# EAGLE schematic 05A-010 (EAGLE 9.6.2)
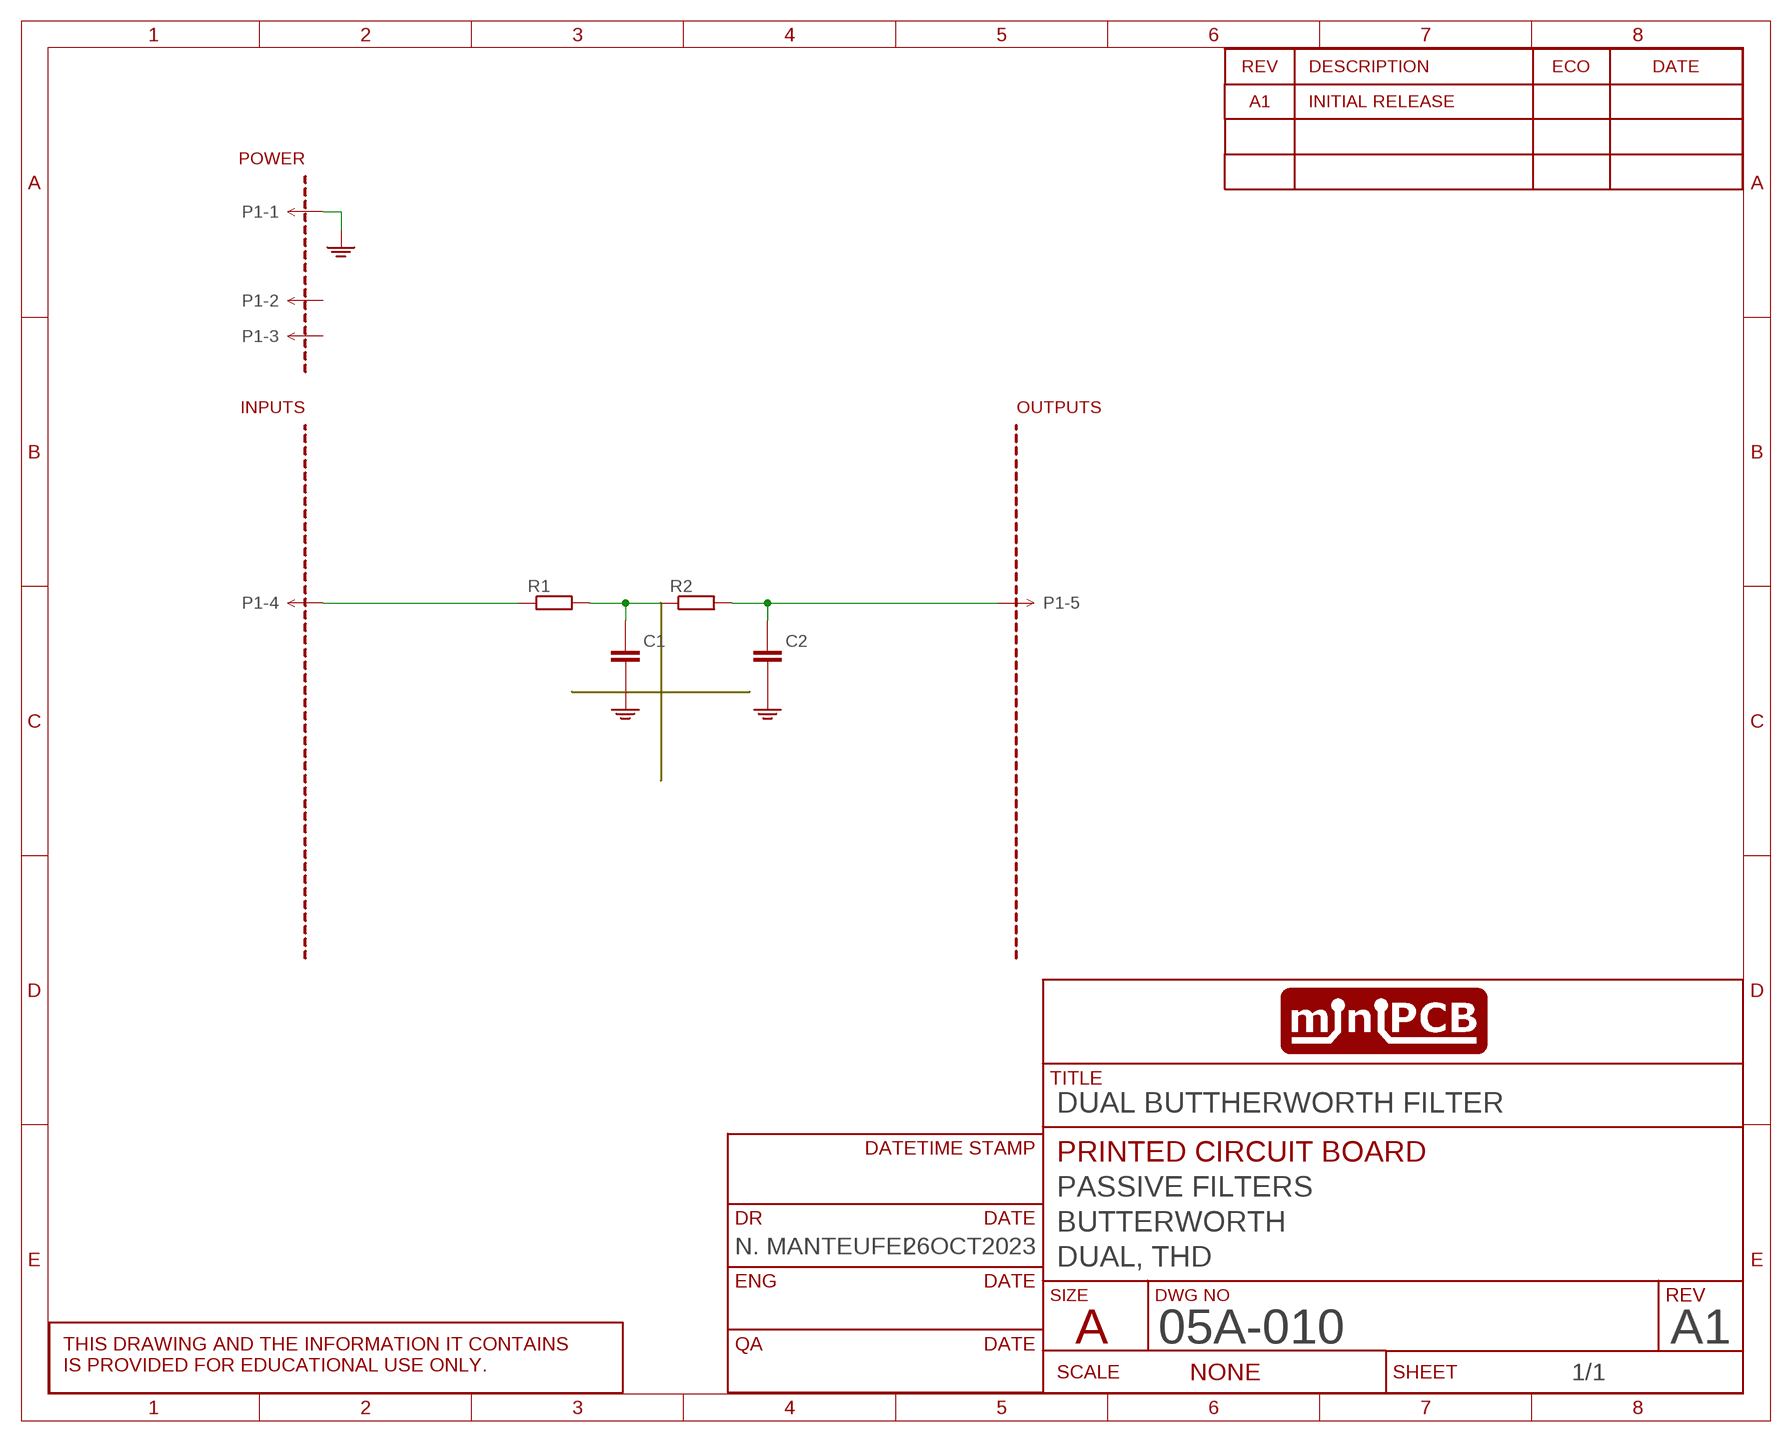
[diagram p0: schematic, sheet 1]
SHEET1 (SCHEMATIC): CIRCUIT_CATEGORY: PASSIVE FILTERS; CIRCUIT_NAME: BUTTERWORTH; CIRCUIT_VARIANT: DUAL, THD; DR: N. MANTEUFEL; DR_DATE: 26OCT2023; PCB_PCBA: PRINTED CIRCUIT BOARD; REVA: A1; REVISION: A1; TITLE: DUAL BUTTHERWORTH FILTER

## Parts
C1  CAPACITORTHD  [C050-024X044]
C2  CAPACITORTHD  [C050-024X044]
P1  MINIPCB_5P5P  [PINS_1X5]
PCB1  MINIPCB_0P00A-20X33  [MINIPCB_00A_20X33]
R1  RESISTORTHD  [0204/10]
R2  RESISTORTHD  [0204/10]

## Nets
GND: C1.2(-) C2.2(-) P1.1
N$1: P1.4 R1.1
N$2: C1.1(+) R1.2 R2.1
N$3: C2.1(+) P1.5 R2.2
Unconnected: P1.2 P1.3

## Library data of the parts
C1 C2 = minipcb:CAPACITOR
P1 = minipcb:MINIPCB_5P
PCB1 = minipcb:MINIPCB_0P; CIRCUIT_CATEGORY: CIRCUIT CATEGORY; REVISION: A1; TITLE: TITLE
R1 R2 = minipcb:RESISTOR